# Altium schematic sheet 12V_Supply.SchDoc: 12V Supply
size OrCAD A; DocumentNumber: LM-008; Revision: C; SheetNumber: 6; SheetTotal: 6
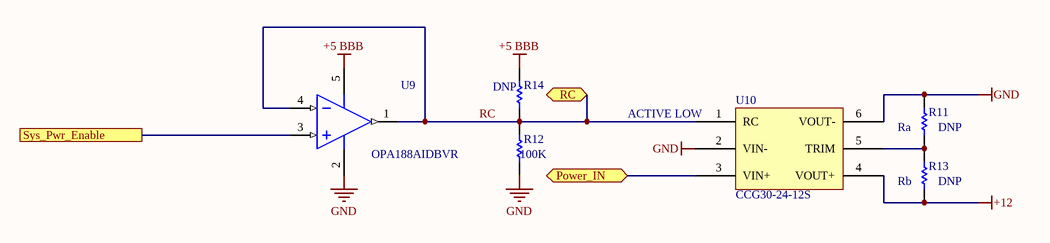
[diagram p0: 12V_Supply.SchDoc]

## Parts
R11  DNP  [RESC0805(2012)_M]
R12  Resistance: 100K  [RESC0805(2012)_M]  (hidden comment: RES SMD 100K OHM 1% 1/8W 0805)
R13  DNP  [RESC0805(2012)_M]
R14  DNP  [RESC0805(2012)_M]
U9  OPA188AIDBVR  [DBV0005A_L]
U10  CCG30-24-12S  [PXB15-24WD05/N]

## Ports
Power_IN, RC, Sys_Pwr_Enable

## Nets
+5 BBB: R14.1 U9.5(V+)
+12: R13.1 U10.4(VOUT+)
GND: R11.2 R12.2 U9.2(V-) U10.2(VIN-) U10.6(VOUT-)
Power_IN: U10.3(VIN+) ; port Power_IN
RC: R12.1 R14.2 U9.1(OUT) U9.4(IN-) U10.1(RC) ; port RC
Sys_Pwr_Enable: U9.3(IN+) ; port Sys_Pwr_Enable
NetR11_1: R11.1 R13.2 U10.5(TRIM)

## Notes on the sheet
- (near U10) ACTIVE LOW
- (near R11) Ra
- (near R13) Rb
- Title
- Size:
- Date:
- Orcad A
- Number:
- Time:
- Revision:
- Sheet
- of
- ZLS Corporation
- 7801 North Lamar Blvd.
- Suite E-184
- Austin, Texas 78752  USA
- (512) 453-0288
- File:

## Library data of the parts
R11 = CMP-1013-00017-1: Vout = 12.05 ­ (445.7 / 63.1+Ra)
R12 = CMP-1013-00017-1: Manufacturer: Vishay; Manufacturer Part Number: CRCW0805100KFKEA; Temperature Coefficient: 100ppm/°C; Power Rating: 125mW; Voltage Rating: 150V; Supplier 1: Avnet; Supplier Part Number 1: CRCW0805100KFKEA/BKN; Stock 1: 1317; Pricing 1: 1=0.1, 10=0.049, 25=0.042, 50=0.035, 100=0.028 (USD); Mount: Surface Mount; Case/Package: 0805; Number of Pins: 2; Weight: 0.000194oz; Contact Plating: Tin; Case Code (Imperial): 0805; Case Code (Metric): 2012; Min Operating Temperature: -55°C; Max Operating Temperature: 155°C; Tolerance: 1%; Composition: Thick Film; Termination: SMD/SMT; Packaging: Tape and Reel; Package Quantity: 5000; Military Standard: Not; Voltage Rating (DC): 150V; Length: 2mm; Height: 0.45mm; Width: 1.25mm; Depth: 1.25mm; Radiation Hardening: No; Lead Free: Lead Free; REACH SVHC: Unknown; ComponentLink1URL: https://datasheet.ciiva.com/11809/0900766b80d98b26-11809057.pdf; ComponentLink1Description: https://datasheet.ciiva.com/11809/0900766b80d98b26-11809057.pdf; ComponentLink2URL: https://datasheet.ciiva.com/7777/1697337-7777349.pdf; ComponentLink2Description: https://datasheet.ciiva.com/7777/1697337-7777349.pdf; ComponentLink3URL: https://datasheet.ciiva.com/3258/dcrcwe3-3258006.pdf; ComponentLink3Description: https://datasheet.ciiva.com/3258/dcrcwe3-3258006.pdf; ComponentLink4URL: https://datasheet.ciiva.com/16754/70201119-16754822.pdf; ComponentLink4Description: https://datasheet.ciiva.com/16754/70201119-16754822.pdf; ComponentLink5URL: https://datasheet.ciiva.com/8337/dcrcwe3-8337738.pdf; ComponentLink5Description: https://datasheet.ciiva.com/8337/dcrcwe3-8337738.pdf; ComponentLink6URL: https://datasheet.ciiva.com/16341/dcrcwe3-16341530.pdf; ComponentLink6Description: https://datasheet.ciiva.com/16341/dcrcwe3-16341530.pdf; ComponentLink7URL: https://datasheet.ciiva.com/16852/dcrcwe3-16852810.pdf; ComponentLink7Description: https://datasheet.ciiva.com/16852/dcrcwe3-16852810.pdf; ComponentLink8URL: https://datasheet.ciiva.com/16720/70201119-16720891.pdf; ComponentLink8Description: https://datasheet.ciiva.com/16720/70201119-16720891.pdf; ComponentLink9URL: https://datasheet.ciiva.com/7777/1720486-7777565.pdf; ComponentLink9Description: https://datasheet.ciiva.com/7777/1720486-7777565.pdf
R13 = CMP-1013-00017-1: Vout = 12.05 + (50.96 / 22+Rb)
R14 = CMP-1013-00017-1: RES SMD 100K OHM 1% 1/8W 0805; Manufacturer: Vishay; Manufacturer Part Number: CRCW0805100KFKEA; Temperature Coefficient: 100ppm/°C; Power Rating: 125mW; Voltage Rating: 150V; Supplier 1: Avnet; Supplier Part Number 1: CRCW0805100KFKEA/BKN; Stock 1: 1317; Pricing 1: 1=0.1, 10=0.049, 25=0.042, 50=0.035, 100=0.028 (USD); Mount: Surface Mount; Case/Package: 0805; Number of Pins: 2; Weight: 0.000194oz; Contact Plating: Tin; Case Code (Imperial): 0805; Case Code (Metric): 2012; Min Operating Temperature: -55°C; Max Operating Temperature: 155°C; Tolerance: 1%; Composition: Thick Film; Resistance: 100K; Termination: SMD/SMT; Packaging: Tape and Reel; Package Quantity: 5000; Military Standard: Not; Voltage Rating (DC): 150V; Length: 2mm; Height: 0.45mm; Width: 1.25mm; Depth: 1.25mm; Radiation Hardening: No; Lead Free: Lead Free; REACH SVHC: Unknown; ComponentLink1URL: https://datasheet.ciiva.com/11809/0900766b80d98b26-11809057.pdf; ComponentLink1Description: https://datasheet.ciiva.com/11809/0900766b80d98b26-11809057.pdf; ComponentLink2URL: https://datasheet.ciiva.com/7777/1697337-7777349.pdf; ComponentLink2Description: https://datasheet.ciiva.com/7777/1697337-7777349.pdf; ComponentLink3URL: https://datasheet.ciiva.com/3258/dcrcwe3-3258006.pdf; ComponentLink3Description: https://datasheet.ciiva.com/3258/dcrcwe3-3258006.pdf; ComponentLink4URL: https://datasheet.ciiva.com/16754/70201119-16754822.pdf; ComponentLink4Description: https://datasheet.ciiva.com/16754/70201119-16754822.pdf; ComponentLink5URL: https://datasheet.ciiva.com/8337/dcrcwe3-8337738.pdf; ComponentLink5Description: https://datasheet.ciiva.com/8337/dcrcwe3-8337738.pdf; ComponentLink6URL: https://datasheet.ciiva.com/16341/dcrcwe3-16341530.pdf; ComponentLink6Description: https://datasheet.ciiva.com/16341/dcrcwe3-16341530.pdf; ComponentLink7URL: https://datasheet.ciiva.com/16852/dcrcwe3-16852810.pdf; ComponentLink7Description: https://datasheet.ciiva.com/16852/dcrcwe3-16852810.pdf; ComponentLink8URL: https://datasheet.ciiva.com/16720/70201119-16720891.pdf; ComponentLink8Description: https://datasheet.ciiva.com/16720/70201119-16720891.pdf; ComponentLink9URL: https://datasheet.ciiva.com/7777/1720486-7777565.pdf; ComponentLink9Description: https://datasheet.ciiva.com/7777/1720486-7777565.pdf
U9 = CMP-0809-00006-2: Precision, Low Noise, Rail-to-Rail Output, Zero-Drift Operational Amplifier, 4 to 36 V, -40 to 125 degC, 5-pin SOT23 (DBV5), Green (RoHS & no Sb/Br); Manufacturer: Texas Instruments; Slew Rate: 0.8 V/µs; Current - Supply: 450µA; Voltage - Supply, Single/Dual (±): 4 V ~ 36 V, ±2 V ~ 18 V; Supplier 1: Digi-Key; Supplier Part Number 1: 296-40438-1-ND; Manufacturer Part Number: OPA188AIDBVR; RoHS: RoHS Compliant; Category: Integrated Circuits (ICs); Stock 1: 195; Pricing 1: 1=2.46, 10=2.211, 100=1.7771, 500=1.46002, 1000=1.20974 (USD); Packaging: Cut Tape (CT); Part Status: Active; Amplifier Type: Zero-Drift; Output Type: Rail-to-Rail; Operating Temperature: -40°C ~ 125°C; Mounting Type: Surface Mount; Package / Case: SC-74A, SOT-753; Supplier Device Package: SOT-23-5; ComponentLink1URL: http://www.ti.com/lit/ds/symlink/opa188.pdf; ComponentLink1Description: http://www.ti.com/lit/ds/symlink/opa188.pdf
U10 = CCG302412S: DC DC CONVERTER 12V 30W; Manufacturer: TDK-Lambda Americas Inc.; Voltage - Input (Min): 9V; Voltage - Input (Max): 36V; Current - Output (Max): 2.5A; Efficiency: 89%; Control Features: Enable, Active Low; Supplier 1: Digi-Key; Manufacturer Part Number: CCG302412S; RoHS: RoHS Compliant; Category: Power Supplies - Board Mount; Stock 1: 269; Pricing 1: 1=41.1, 10=40.25 (USD); Packaging: Tray; Part Status: Active; Type: Isolated Module; Voltage - Output 1: 12V; Voltage - Output 2: -; Voltage - Output 3: -; Applications: ITE (Commercial); Features: Remote On/Off, OCP, OVP; Operating Temperature: -40°C ~ 85°C; Mounting Type: Through Hole; Package / Case: 6-DIP Module; Size / Dimension: 1.00" L x 1.00" W x 0.39" H (25.4mm x 25.4mm x 9.9mm); ComponentLink1URL: http://www.us.tdk-lambda.com/ftp/specs/ccg30.pdf; ComponentLink1Description: http://www.us.tdk-lambda.com/ftp/specs/ccg30.pdf; Supplier Part Number 1: 285-2419-ND